# Altium schematic sheet Power_3V3.SchDoc
size A4; SheetNumber: 5; SheetTotal: 6
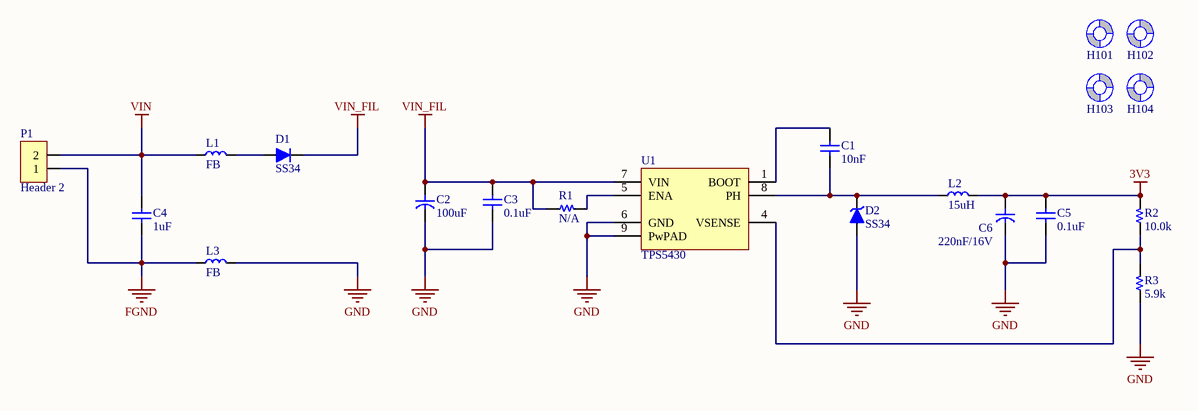
[diagram p0: Power_3V3.SchDoc]

## Parts
C1  10nF  [C 0805]
C2  100uF  [C SMD TAN 1206 (A)]
C3  0.1uF  [C 0805]
C4  1uF  [C 0805]
C5  0.1uF  [C 0805]
C6  220nF/16V  [C SMD TAN 1206 (A)]
D1  SS34  [DO-35 (SOD27 )]
D2  SS34  [DO-214AC (SMA)]
H101  Screw Hole  [SCREW/3.2/7.0/M]  (value not drawn)  (no BOM)
H102  Screw Hole  [SCREW/3.2/7.0/M]  (value not drawn)  (no BOM)
H103  Screw Hole  [SCREW/3.2/7.0/M]  (value not drawn)  (no BOM)
H104  Screw Hole  [SCREW/3.2/7.0/M]  (value not drawn)  (no BOM)
L1  FB  [Inductor SMD 0805 (2012)]
L2  15uH  [Inductor SMD 0805 (2012)]
L3  FB  [Inductor SMD 0805 (2012)]
P1  Header 2  [HDR/Header/2/BOX/RED]
R1  N/A  [R 0805]
R2  10.0k  [R 0805]
R3  5.9k  [R 0805]
U1  TPS5430  [SOIC-8 EP]

## Nets
3V3: C5.1 C6.1 L2.2 R2.2
FGND: C4.2 L3.1 P1.1
GND: C2.2 C3.2 C5.2 C6.2 D2.1(A) L3.2 R3.1 U1.6(GND) U1.9(PwPAD)
VIN: C4.1 L1.1 P1.2
VIN_FIL: C2.1 C3.1 D1.2(K) R1.1 U1.7(VIN)
NetC1_1: C1.1 U1.1(BOOT)
NetC1_2: C1.2 D2.2(K) L2.1 U1.8(PH)
NetD1_1: D1.1(A) L1.2
NetR1_2: R1.2 U1.5(ENA)
NetR2_1: R2.1 R3.2 U1.4(VSENSE)

Not connected (* = marked no-connect by the designer): H101 1(Screw); H102 1(Screw); H103 1(Screw); H104 1(Screw)

## Library data of the parts
C1 C3-C5 = Capacitor NP: Capacitor non-pol
C2 C6 = Capacitor: Capacitor pol
D1 = Diode: Default Diode
D2 = Diode Zener: Zener Diode
L1-L3 = Inductor
P1 = Header 2: Header, 2-Pin
R1-R3 = Resistor
U1 = TPS54xx: 3/5A, Wide input range, Step-down SWIFT DC-DC Converter
H101-H104 = Screw Hole: TYPE: NO-BOM; UNIT PRICE: 0